# Altium schematic sheet Placa desarrollo PIC16F877A.SchDoc
size A4; SheetNumber: 1; SheetTotal: 1
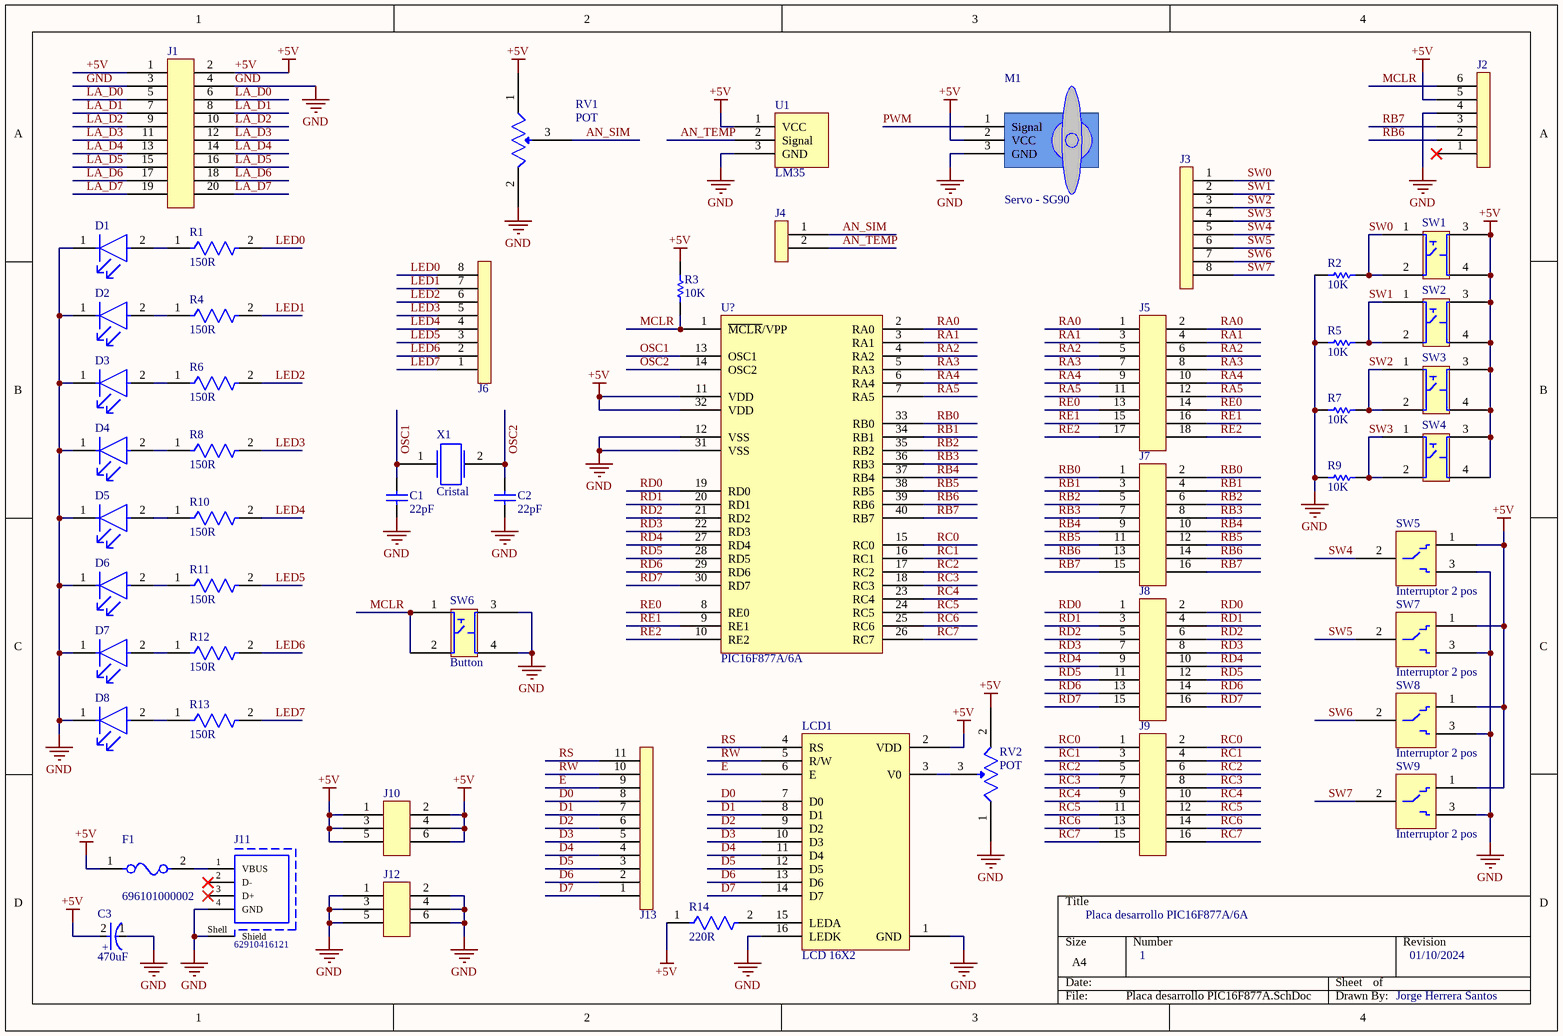
[diagram p0: Placa desarrollo PIC16F877A.SchDoc]

## Parts
C1  22pF  [CAPC2013X145X50NL20T20]
C2  22pF  [CAPC2013X145X50NL20T20]
C3  470uF  [FP-OS-CON-SMT-F12-MFG]
D1  HLMP-1301  [FP-HLMP-1301-MFG]  (value not drawn)
D2  HLMP-1301  [FP-HLMP-1301-MFG]  (value not drawn)
D3  HLMP-1301  [FP-HLMP-1301-MFG]  (value not drawn)
D4  HLMP-1301  [FP-HLMP-1301-MFG]  (value not drawn)
D5  HLMP-1301  [FP-HLMP-1301-MFG]  (value not drawn)
D6  HLMP-1301  [FP-HLMP-1301-MFG]  (value not drawn)
D7  HLMP-1301  [FP-HLMP-1301-MFG]  (value not drawn)
D8  HLMP-1301  [FP-HLMP-1301-MFG]  (value not drawn)
F1  696101000002  [FP-696101000002-MFG]
J1  2x10 conn 2,54 pitch  [2x10 conn 2,54mm]  (value not drawn)
J2  PICKIT CONN  [1x6 conn 2,54mm 90º angle]  (value not drawn)
J3  1x8 conn 2,54 pitch  [1x8 conn 2,54mm]  (value not drawn)
J4  1x2 conn 2,54 pitch  [1x2 conn 2,54mm]  (value not drawn)
J5  2x9 conn 2,54 pitch  [2x9conn 2,54mm]  (value not drawn)
J6  1x8 conn 2,54 pitch  [1x8 conn 2,54mm]  (value not drawn)
J7  2x8 conn 2,54 pitch_1  [2x8 conn 2,54mm]  (value not drawn)
J8  2x8 conn 2,54 pitch_1  [2x8 conn 2,54mm]  (value not drawn)
J9  2x8 conn 2,54 pitch_1  [2x8 conn 2,54mm]  (value not drawn)
J10  2x3 conn 2,54 pitch  [2x3 conn 2,54mm]  (value not drawn)
J11  62910416121  [62910416121]
J12  2x3 conn 2,54 pitch  [2x3 conn 2,54mm]  (value not drawn)
J13  1x11 conn 2,54 pitch  [1x11 conn 2,54mm]  (value not drawn)
LCD1  LCD 16X2  [LCD 16x2]
M1  Servo - SG90  [Servo - SG90]
R1  150R  [FP-ERJ6GE-MFG]
R2  10K  [RESC1608X55X25NL10T15]
R3  10K  [RESC1608X55X25NL10T15]
R4  150R  [FP-ERJ6GE-MFG]
R5  10K  [RESC1608X55X25NL10T15]
R6  150R  [FP-ERJ6GE-MFG]
R7  10K  [RESC1608X55X25NL10T15]
R8  150R  [FP-ERJ6GE-MFG]
R9  10K  [RESC1608X55X25NL10T15]
R10  150R  [FP-ERJ6GE-MFG]
R11  150R  [FP-ERJ6GE-MFG]
R12  150R  [FP-ERJ6GE-MFG]
R13  150R  [FP-ERJ6GE-MFG]
R14  220R  [FP-CRCW0805-e3-IPC_A]
RV1  POT  [POT]
RV2  POT  [POT]
SW1  Button  [Button]  (value not drawn)
SW2  Button  [Button]  (value not drawn)
SW3  Button  [Button]  (value not drawn)
SW4  Button  [Button]  (value not drawn)
SW5  Interruptor 2 pos  [INT 2POS]
SW6  Button  [Button]
SW7  Interruptor 2 pos  [INT 2POS]
SW8  Interruptor 2 pos  [INT 2POS]
SW9  Interruptor 2 pos  [INT 2POS]
U1  LM35  [LM35]
U?  PIC16F877A/6A  [PIC16F877A/6A]
X1  Cristal  [Cristal]

## Nets
+5V: C3.2(A) F1.1 J1.1 J1.2 J2.5 J10.1 J10.2 J10.3 J10.4 J10.5 J10.6 LCD1.2(VDD) M1.2(VCC) R3.2 R14.1 RV1.1 RV2.2 SW1.3 SW1.4 SW2.3 SW2.4 SW3.3 SW3.4 SW4.3 SW4.4 SW5.1 SW7.1 SW8.1 SW9.1 U1.1(VCC) U?.11(VDD) U?.32(VDD)
GND: C1.1 C2.1 C3.1(C) D1.1(C) D2.1(C) D3.1(C) D4.1(C) D5.1(C) D6.1(C) D7.1(C) D8.1(C) J1.3 J1.4 J2.4 J11.4(GND) J11.Shell(Shield) J12.1 J12.2 J12.3 J12.4 J12.5 J12.6 LCD1.1(GND) LCD1.16(LEDK) M1.3(GND) R2.1 R5.1 R7.1 R9.1 RV1.2 RV2.1 SW5.3 SW6.3 SW6.4 SW7.3 SW8.3 SW9.3 U1.3(GND) U?.12(VSS) U?.31(VSS)
AN_SIM: J4.1 RV1.3
AN_TEMP: J4.2 U1.2(Signal)
D0: J13.8 LCD1.7(D0)
D1: J13.7 LCD1.8(D1)
D2: J13.6 LCD1.9(D2)
D3: J13.5 LCD1.10(D3)
D4: J13.4 LCD1.11(D4)
D5: J13.3 LCD1.12(D5)
D6: J13.2 LCD1.13(D6)
D7: J13.1 LCD1.14(D7)
E: J13.9 LCD1.6(E)
LA_D0: J1.5 J1.6
LA_D1: J1.7 J1.8
LA_D2: J1.9 J1.10
LA_D3: J1.11 J1.12
LA_D4: J1.13 J1.14
LA_D5: J1.15 J1.16
LA_D6: J1.17 J1.18
LA_D7: J1.19 J1.20
LED0: J6.8 R1.2
LED1: J6.7 R4.2
LED2: J6.6 R6.2
LED3: J6.5 R8.2
LED4: J6.4 R10.2
LED5: J6.3 R11.2
LED6: J6.2 R12.2
LED7: J6.1 R13.2
MCLR: J2.6 R3.1 SW6.1 SW6.2 U?.1(~{MCLR}/VPP)
OSC1: C1.2 U?.13(OSC1) X1.1
OSC2: C2.2 U?.14(OSC2) X1.2
PWM: M1.1(Signal)
RA0: J5.1 J5.2 U?.2(RA0)
RA1: J5.3 J5.4 U?.3(RA1)
RA2: J5.5 J5.6 U?.4(RA2)
RA3: J5.7 J5.8 U?.5(RA3)
RA4: J5.9 J5.10 U?.6(RA4)
RA5: J5.11 J5.12 U?.7(RA5)
RB0: J7.1 J7.2 U?.33(RB0)
RB1: J7.3 J7.4 U?.34(RB1)
RB2: J7.5 J7.6 U?.35(RB2)
RB3: J7.7 J7.8 U?.36(RB3)
RB4: J7.9 J7.10 U?.37(RB4)
RB5: J7.11 J7.12 U?.38(RB5)
RB6: J2.2 J7.13 J7.14 U?.39(RB6)
RB7: J2.3 J7.15 J7.16 U?.40(RB7)
RC0: J9.1 J9.2 U?.15(RC0)
RC1: J9.3 J9.4 U?.16(RC1)
RC2: J9.5 J9.6 U?.17(RC2)
RC3: J9.7 J9.8 U?.18(RC3)
RC4: J9.9 J9.10 U?.23(RC4)
RC5: J9.11 J9.12 U?.24(RC5)
RC6: J9.13 J9.14 U?.25(RC6)
RC7: J9.15 J9.16 U?.26(RC7)
RD0: J8.1 J8.2 U?.19(RD0)
RD1: J8.3 J8.4 U?.20(RD1)
RD2: J8.5 J8.6 U?.21(RD2)
RD3: J8.7 J8.8 U?.22(RD3)
RD4: J8.9 J8.10 U?.27(RD4)
RD5: J8.11 J8.12 U?.28(RD5)
RD6: J8.13 J8.14 U?.29(RD6)
RD7: J8.15 J8.16 U?.30(RD7)
RE0: J5.13 J5.14 U?.8(RE0)
RE1: J5.15 J5.16 U?.9(RE1)
RE2: J5.17 J5.18 U?.10(RE2)
RS: J13.11 LCD1.4(RS)
RW: J13.10 LCD1.5(R/W)
SW0: J3.1 R2.2 SW1.1 SW1.2
SW1: J3.2 R5.2 SW2.1 SW2.2
SW2: J3.3 R7.2 SW3.1 SW3.2
SW3: J3.4 R9.2 SW4.1 SW4.2
SW4: J3.5 SW5.2
SW5: J3.6 SW7.2
SW6: J3.7 SW8.2
SW7: J3.8 SW9.2
NetD1_2: D1.2(A) R1.1
NetD2_2: D2.2(A) R4.1
NetD3_2: D3.2(A) R6.1
NetD4_2: D4.2(A) R8.1
NetD5_2: D5.2(A) R10.1
NetD6_2: D6.2(A) R11.1
NetD7_2: D7.2(A) R12.1
NetD8_2: D8.2(A) R13.1
NetF1_2: F1.2 J11.1(VBUS)
NetLCD1_3: LCD1.3(V0) RV2.3
NetLCD1_15: LCD1.15(LEDA) R14.2

Not connected (* = marked no-connect by the designer): J2 1*; J11 2(D-)* 3(D+)*

## Notes on the sheet
- Placa desarrollo PIC16F877A/6A
- 1
- 01/10/2024
- Jorge Herrera Santos
- (in symbol CMP-05428-000164-1) +

## Library data of the parts
C1 C2 = CMP-1036-01227-2: Manufacturer: Vitramon; Part Number: VJ0805A220GXXCW1BC
C3 = CMP-05428-000164-1: Conductive Polymer Aluminum Solid Capacitors (OS-CON) 470uF ±20% 16V RADIAL SMT 10x12.6mm; Leakage Current: 1.504mA; Polarity: Polar; Life (Hours): 2000Hour; ESR (Equivalent Series Resistance): 10mR; Dissipation Factor: 12%; Ripple Current: 6.1A; Lead Free: Lead Free; Voltage: 16V; Min Operating Temperature: -55°C; Case/Package: Radial; RoHS Compliant: Yes; Voltage Rating: 16V; Mount: Surface Mount; Tolerance: 20%; Voltage Rating (DC): 16V; REACH SVHC: No SVHC; Height: 12.6mm; Max Operating Temperature: 105°C; Construction: Cylindrical; Height - Seated (Max): 0.5inch; Length: 12.6mm; Radiation Hardening: No; Diameter: 10mm; Termination: SMD/SMT; Package Quantity: 400; Series: OS-CON™, SVPE; Number of Pins: 12; Ripple Current (AC): 6.1A; Capacitance: 470uF; Packaging: Tape and Reel
D1-D8 = CMP-18399-000007-1: LED RED DIFFUSED T-1 T/H; Manufacturer: Broadcom; Forward Current: 10mA; Max Junction Temp: +110°C; Wavelength: 626nm; Led Orientation: Straight; Viewing Angle: 60°; Luminous Intensity: 3.4mcd; Forward Voltage: 1.9V; Reverse Voltage: 5V; Peak Emmision Wavelength: 635nm; Mouser Description: Standard LEDs - Through Hole Red Diffused 635nm 3.4mcd; RoHS: TRUE; ComponentLink2Description: Datasheet; Device Class L1: Optoelectronics; Temperature Range High: +100°C; Manufacturer Part Number: HLMP-1301; ComponentLink2URL: https://docs.broadcom.com/docs/AV02-1555EN; Colour: Red; Digikey Description: LED RED DIFFUSED T-1 T/H; Automotive: No; Device Class L2: LEDs; Temperature Range Low: -40°C; Octopart: https://octopart.com/hlmp-1301-broadcom-71130345; Category: Diode; Lead Free: Yes; Device Class L3: unset; Package: 0; Temperature: -40°C to +100°C
F1 = CMP-1502-00233-2: FUSEHOLDER BLOCKS - PCB - CLIP C; Fuse Current: 10A; Voltage: 250V; Number of Circuits: 1; Fuse Size: 0.197 Dia x 0.787 L (5mm x 20mm); Contact Plating: Tin; Series: -; Current Rating: 10A; Contact Material: Copper Alloy; Termination: PC Pin; Voltage Rating (AC): 250V; RoHS Compliant: Yes; Orientation: Horizontal; Mount: Through Hole
J1 = 2x10 conn 2,54 pitch: Male header connector 2,54 pitch 2x10 pins
J2 = 1x6 conn 2,54 pitch 90º: Male header connector 2,54 pitch 1x6 pins 90 angle
J3 J6 = 1x8 conn 2,54 pitch: Male header connector 2,54 pitch 1x8 pins
J4 = 1x2 conn 2,54 pitch: Male header connector 2,54 pitch 1x2 pins
J5 = 2x9 conn 2,54 pitch: Male header connector 2,54 pitch 2x8 pins
J7-J9 = 2x8 conn 2,54 pitch_1: Male header connector 2,54 pitch 2x8 pins
J10 J12 = 2x3 conn 2,54 pitch: Male header connector 2,54 pitch 2x3 pins
J11 = CMP-1502-03244-1: USB 2.0 Type B Receptacle WR-COM, Horizontal, SMT, with Pads and Pegs; Manufacturer: Wurth Elektronik; Rated Current: 1.5A; Contact Resistance: 20mOhm; Working Voltage: 30VAC; Packaging: TapeandReel; Publisher: WurthElektronik; Orientation: Horizontal; Operating Temperature: -40to105degC; Manufacturer URL: http://www.we-online.de; Connector Type: USB2.0TypeB; Datasheet URL: https://katalog.we-online.de/em/datasheet/62910416121.pdf; Part Number: 62910416121; Package Reference: 62910416121; Gender: Receptacle; Mounting Technology: SMT
J13 = 1x11 conn 2,54 pitch: Male header connector 2,54 pitch 1x11 pins
R1 R4 R6 R8 R10-R13 = CMP-1013-00054-3: RES SMD 150 OHM 5% 1/8W 0805; Manufacturer Part Number: ERJ-6GEYJ151V; Manufacturer: Panasonic; Temperature Coefficient: 200ppm/°C; Voltage Rating: 150V; Value: 150Ω; Power Rating: 0.125W; Automotive Grade: Grade 0; RoHS: TRUE; Series: ERJ; Tolerance: 5%; Height: 0.7mm; Device Class L1: Passive Components; Temperature Range Low: -55°C; Device Class L3: Chip SMD Resistors; Lead Free: Yes; Composition: Thick Film; Temperature: -55°C to +155°C; Mouser Description: Thick Film Resistors - SMD 0805 150ohms 5% Tol; Footprint Url: https://industrial.panasonic.com/cdbs/www-data/pdf/RDA0000/DMA0000COL17.pdf; Device Class L2: Resistors; Category: Res; Ipc Land Pattern Name: RESC200125X60; Temperature Range High: +155°C; ComponentLink2URL: https://industrial.panasonic.com/ww/products/resistors/chip-resistors/general-purpose-chip-resistors/thick-film-chip-resistors/ERJ6GEYJ151V; Package: ERJ6GE; Digikey Description: RES SMD 150 OHM 5% 1/8W 0805; Resistance: 150Ω; ComponentLink2Description: Datasheet; Octopart: https://octopart.com/erj-6geyj151v-panasonic-55422917; Automotive: Yes
R2 R3 R5 R7 R9 = CMP-2000-04239-1: Manufacturer: Yageo; Part Number: RC0603JR-0710KA
R14 = CMP-2001-03683-2: RES Thick Film, 220Ω, 5%, 0.125W, 200ppm/°C, 0805; Voltage Rating: 150V; Power Rating: 125mW; Case Code (Metric): 2012; Height: 0.45mm; Radiation Hardening: No; Contact Plating: Tin; Voltage Rating (DC): 150V; Packaging: Tape and Reel; Lead Free: Lead Free; Military Standard: Not; Temperature Coefficient: 200ppm/°C; Width: 1.25mm; Case Code (Imperial): 0805; Termination: SMD/SMT; Tolerance: 5%; Depth: 1.25mm; Package Quantity: 5000; Weight: 0.000194oz; Length: 2mm; Min Operating Temperature: -55°C; Composition: Thick Film; Resistance: 220R; Case/Package: 0805; Max Operating Temperature: 155°C
RV1 RV2 = POT: Resistencia variable china
SW5 SW7-SW9 = PCB Interruptor